# Altium project dory-x.PrjPcb (part 9 of 12)
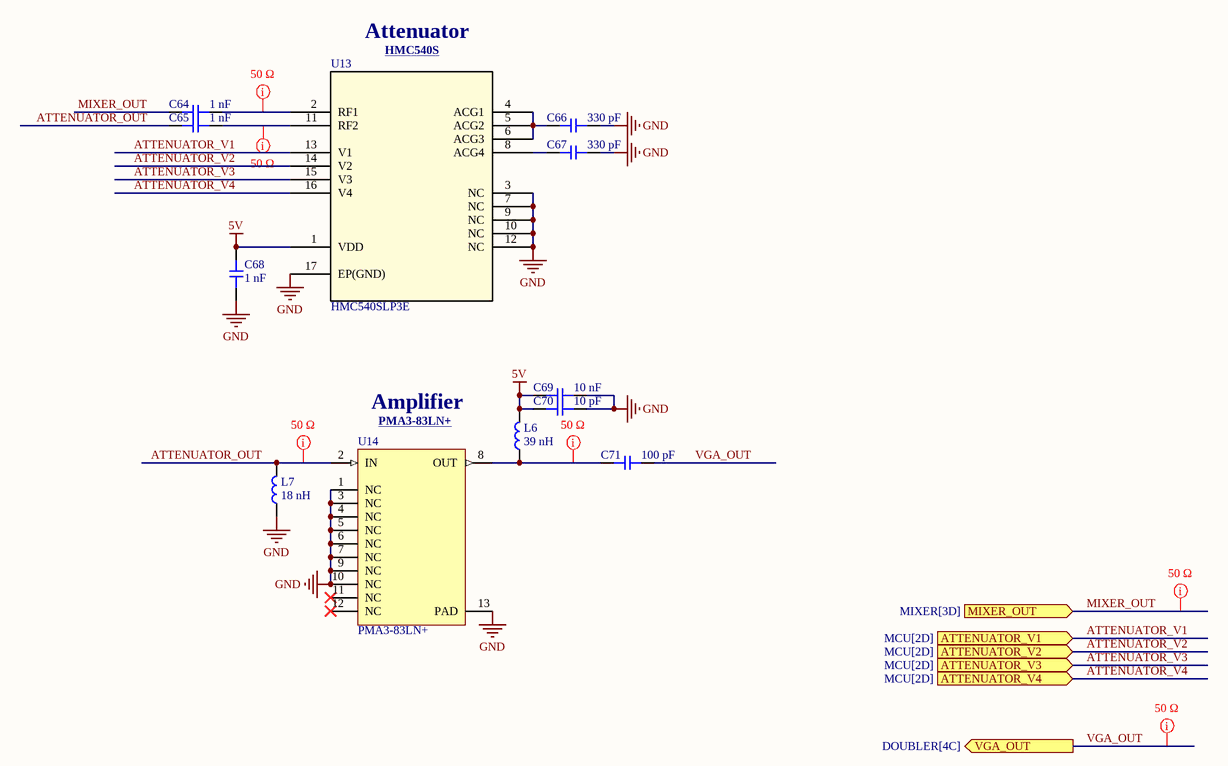
[diagram p15: VGA.SchDoc]

## Sheet VGA.SchDoc (continued)

### Library data of the parts (continued)
U14 = PMA3-83LN+: 1.3dB 0.5GHz~8GHz 21.3dB , LTE, SATCOM, UMTS, WiFi, WiMAX, WLAN QFN-12-EP(3x3) RF Amplifiers ROHS; Manufacturer: Mini-Circuits; Bandwidth: 7.5GHz; Gain: 19.9dB; Impedance: 50Ω; Clock Frequency: 8GHz; Max Junction Temperature (Tj): 150°C; Max Power Dissipation: 950mW; Max Supply Voltage: 6V; Noise Figure: 2.2dB; P1dB: 18dBm; Manufacturer Part Number: PMA3-83LN+; Supplier: DigiKey; Supplier Part Number: 3157-PMA3-83LN+CT-ND; RoHS: Compliant; Category: RF Amplifiers; Stock: 11975; Pricing: 1=23.6, 20=18.852, 50=15.696, 100=14.124, 200=12.43205, 500=11.36404, 2000=9.60007 (USD); Export Control Classification Number (ECCN) Code: EAR99; Height: 990.6µm; Introduction Date: 2015-09-21; Lifecycle Status: Production; Max Operating Temperature: 105°C; Min Operating Temperature: -40°C; REACH SVHC: Yes; ComponentLink1URL: https://datasheet.octopart.com:443/PMA3-83LN%2B-Mini-Circuits-datasheet-180702334.pdf?src-supplier=IHS; ComponentLink1Description: https://datasheet.octopart.com:443/PMA3-83LN%2B-Mini-Circuits-datasheet-180702334.pdf?src-supplier=IHS; ComponentLink2URL: https://datasheet.octopart.com:443/PMA3-83LN%2B-Mini-Circuits-datasheet-86645527.pdf?src-supplier=Upverter; ComponentLink2Description: https://datasheet.octopart.com:443/PMA3-83LN%2B-Mini-Circuits-datasheet-86645527.pdf?src-supplier=Upverter; ComponentLink3URL: https://sigma.octopart.com:443/153600622/technical_drawing/Mini-Circuits-PMA3-83LN%2B.pdf?src-supplier=Upverter; ComponentLink3Description: https://sigma.octopart.com:443/153600622/technical_drawing/Mini-Circuits-PMA3-83LN%2B.pdf?src-supplier=Upverter

## Sheet DOUBLER.SchDoc: Titan Yuan
size Letter; DrawnBy: Titan Yuan; SheetNumber: 5; SheetTotal: 8
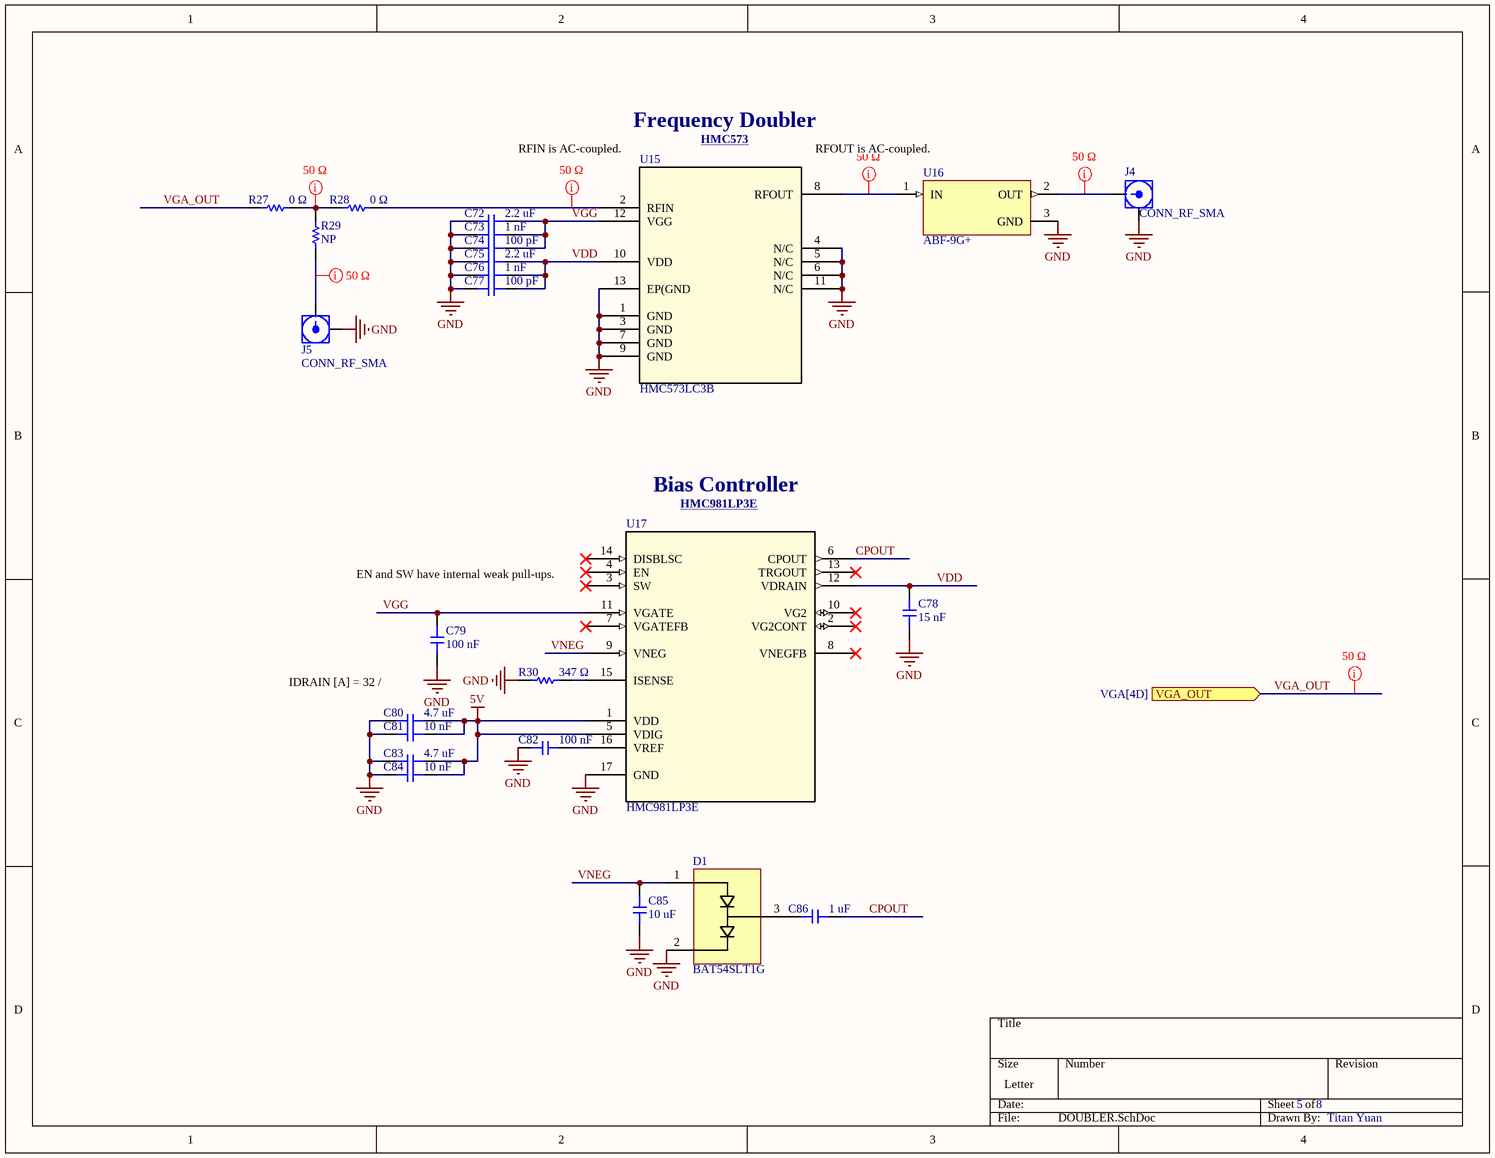
[diagram p4: DOUBLER.SchDoc]

### Parts
C72  2.2 uF  [CAP_0603]
C73  1 nF  [CAP_0402]
C74  100 pF  [CAP_0402]
C75  2.2 uF  [CAP_0603]
C76  1 nF  [CAP_0402]
C77  100 pF  [CAP_0402]
C78  15 nF  [CAP_0402]
C79  100 nF  [CAP_0402]
C80  4.7 uF  [CAP_0603]
C81  10 nF  [CAP_0402]
C82  100 nF  [CAP_0402]
C83  4.7 uF  [CAP_0603]
C84  10 nF  [CAP_0402]
C85  10 uF  [CAP_0805]
C86  1 uF  [CAP_0603]
D1  BAT54SLT1G  [BAT54SL]
J4  CONN_RF_SMA  [142-0701-801]
J5  CONN_RF_SMA  [142-0701-801]
R27  0 Ω  [RES_0402]
R28  0 Ω  [RES_0402]
R29  NP  [RES_0402]
R30  347 Ω  [RES_0603]
U15  HMC573LC3B  [HE_12_1_ADI]
U16  ABF-9G+  [PL-764]
U17  HMC981LP3E  [QFN16_3X3_ADI]

### Ports
VGA_OUT (in, see VGA[4D])

### Nets
5V: C80.2 C81.2 C83.2 C84.2 U17.1(VDD) U17.5(VDIG)
GND: C72.2 C73.2 C74.2 C75.2 C76.2 C77.2 C78.1 C79.1 C80.1 C81.1 C82.1 C83.1 C84.1 C85.1 D1.2 J4.2 J5.2 R30.1 U15.1(GND) U15.3(GND) U15.4(N/C) U15.5(N/C) U15.6(N/C) U15.7(GND) U15.9(GND) U15.11(N/C) U15.13(EP(GND) U16.3(GND) U17.17(GND)
CPOUT: C86.2 U17.6(CPOUT)  [project net CPOUT_5]
VDD: C75.1 C76.1 C77.1 C78.2 U15.10(VDD) U17.12(VDRAIN)  [project net VDD_5]
VGA_OUT: R27.1 ; port VGA_OUT
VGG: C72.1 C73.1 C74.1 C79.2 U15.12(VGG) U17.11(VGATE)  [project net VGG_5]
VNEG: C85.2 D1.1 U17.9(VNEG)  [project net VNEG_5]
NetC82_2: C82.2 U17.16(VREF)
NetC86_1: C86.1 D1.3
NetJ4_1: J4.1 U16.2(OUT)
NetJ5_1: J5.1 R29.2
NetR27_2: R27.2 R28.1 R29.1
NetR28_2: R28.2 U15.2(RFIN)
NetR30_2: R30.2 U17.15(ISENSE)
NetU15_8: U15.8(RFOUT) U16.1(IN)

Not connected (* = marked no-connect by the designer): U17 2(VG2CONT)* 3(SW)* 4(EN)* 7(VGATEFB)* 8(VNEGFB)* 10(VG2)* 13(TRGOUT)* 14(DISBLSC)*

### Layout directives
net class 50 Ω: NetJ4_1, NetJ5_1, NetR27_2, NetR28_2, NetU15_8, VGA_OUT

### Notes on the sheet
- (near U15) RFIN is AC-coupled.
- Frequency Doubler
- (near U15) HMC573 <https://www.analog.com/en/products/hmc573.html>
- RFOUT is AC-coupled.
- Bias Controller
- (near U17) HMC981LP3E <https://www.analog.com/en/products/hmc981lp3e.html>
- EN and SW have internal weak pull-ups.
- IDRAIN [A] = 32 / @{"Id":"COOUFFRD\UTDWNBPI","ObjectType":2}
### Library data of the parts
C72 C75 = CAP: 25V 2.2uF X7R ±10% 0603 Multilayer Ceramic Capacitors MLCC - SMD/SMT ROHS; Manufacturer: Murata Electronics; Manufacturer Part Number: GRM188Z71E225KE43D; Manufacturer Lifecycle Status: IN PRODUCTION; Tolerance: +-10%; Value: 2.2µF; Voltage Rating: 25 V; Dielectric: Ceramic; Package Size: 0603; Supplier: DigiKey; Supplier Part Number: 490-GRM188Z71E225KE43DCT-ND; RoHS: Compliant; Category: Ceramic Capacitors; Stock: 81169; Pricing: 1=0.16, 10=0.092, 50=0.0704, 100=0.0565, 500=0.04888, 1000=0.04487 (USD); Case/Package: 0603; Dielectric Material: Ceramic; Export Control Classification Number (ECCN) Code: EAR99; Height: 800µm; Harmonized Tariff Schedule (HTS) Code: 8532.24.00.20; Introduction Date: 2017-02-21; Length: 1.6mm; Lifecycle Status: Production; Material: Ceramic; Max Operating Temperature: 125°C; Min Operating Temperature: -55°C; Mounting Technology: Surface Mount; Number of Terminals: 2; REACH SVHC: Yes; Thickness: 800µm; Voltage Rating (DC): 25V; Width: 800µm; ComponentLink1URL: https://datasheet.octopart.com:443/GRM188Z71E225KE43D-Murata-datasheet-141276026.pdf?src-supplier=Geoflip; ComponentLink1Description: https://datasheet.octopart.com:443/GRM188Z71E225KE43D-Murata-datasheet-141276026.pdf?src-supplier=Geoflip; ComponentLink2URL: https://datasheet.octopart.com:443/GRM188Z71E225KE43D-Murata-datasheet-165579666.pdf?src-supplier=TME; ComponentLink2Description: https://datasheet.octopart.com:443/GRM188Z71E225KE43D-Murata-datasheet-165579666.pdf?src-supplier=TME; ComponentLink3URL: https://datasheet.octopart.com:443/GRM188Z71E225KE43D-Murata-datasheet-140705919.pdf?src-supplier=Ciiva; ComponentLink3Description: https://datasheet.octopart.com:443/GRM188Z71E225KE43D-Murata-datasheet-140705919.pdf?src-supplier=Ciiva; ComponentLink4URL: https://datasheet.octopart.com:443/GRM188Z71E225KE43D-Murata-datasheet-138743437.pdf?src-supplier=Ciiva; ComponentLink4Description: https://datasheet.octopart.com:443/GRM188Z71E225KE43D-Murata-datasheet-138743437.pdf?src-supplier=Ciiva; ComponentLink5URL: http://sigma.octopart.com:80/reach_statement/Murata-company-16.pdf?src-supplier=Compliance+Statements; ComponentLink5Description: http://sigma.octopart.com:80/reach_statement/Murata-company-16.pdf?src-supplier=Compliance+Statements
C73 C76 = CAP: 50V 1nF X7R ±10% 0402 Multilayer Ceramic Capacitors MLCC - SMD/SMT ROHS; Manufacturer: Yageo; Manufacturer Part Number: CC0402KRX7R9BB102; Tolerance: +-10%; Insulation Resistance: 100GΩ; Temperature Coefficient: 30ppm/°C; Voltage Rating: 50 V; Dielectric: Ceramic; Package Size: 0402; Supplier: DigiKey; Supplier Part Number: 311-1036-1-ND; RoHS: Compliant; Category: Ceramic Capacitors; Stock: 3090255; Pricing: 1=0.08, 10=0.004 (USD); Value: 1nF; Case/Package: 0402; Case Code (Imperial): 0402; Case Code (Metric): 1005; China RoHS: Compliant; Composition: Ceramic; Country of Origin: Mainland China, Taiwan; Depth: 500µm; Dielectric Material: Ceramic; Export Control Classification Number (ECCN) Code: EAR99; Halogen Free: Halogen Free; Height: 500µm; Harmonized Tariff Schedule (HTS) Code: 8532.24.00.20; Introduction Date: 2003-01-27; Lead Free: Lead Free; Length: 1mm; Lifecycle Status: Production; Material: Ceramic; Max Operating Temperature: 125°C; Min Operating Temperature: -55°C; Mounting Technology: Surface Mount; Pins: 2; Number of Terminals: 2; Radiation Hardening: No; REACH SVHC: Yes; Schedule B: 8532240020, 8532240020|8532240020|8532240020|8532240020|8532240020|8532240020|8532240020|8532240020|8532240020|8532240020|8532240020|8532240020|8532240020|8532240020|8532240020|8532240020|8532240020|8532240020|8532240020|8532240020|8532240020|8532240020|8532240020|85; Termination: SMD/SMT; Thickness: 558.8µm; Voltage: 50V; Voltage Rating (AC): 50V; Voltage Rating (DC): 50V; Width: 500µm; ComponentLink1URL: https://datasheet.octopart.com:443/CC0402KRX7R9BB102-Yageo-datasheet-177165144.pdf?src-supplier=IHS; ComponentLink1Description: https://datasheet.octopart.com:443/CC0402KRX7R9BB102-Yageo-datasheet-177165144.pdf?src-supplier=IHS; ComponentLink2URL: https://datasheet.octopart.com:443/CC0402KRX7R9BB102-Yageo-datasheet-82288757.pdf?src-supplier=Upverter; ComponentLink2Description: https://datasheet.octopart.com:443/CC0402KRX7R9BB102-Yageo-datasheet-82288757.pdf?src-supplier=Upverter; ComponentLink3URL: https://datasheet.octopart.com:443/CC0402KRX7R9BB102-Yageo-datasheet-78855684.pdf?src-supplier=Upverter; ComponentLink3Description: https://datasheet.octopart.com:443/CC0402KRX7R9BB102-Yageo-datasheet-78855684.pdf?src-supplier=Upverter; ComponentLink4URL: https://datasheet.octopart.com/CC0402KRX7R9BB102-Yageo-datasheet-10883670.pdf; ComponentLink4Description: https://datasheet.octopart.com/CC0402KRX7R9BB102-Yageo-datasheet-10883670.pdf; ComponentLink5URL: https://datasheet.octopart.com:443/CC0402KRX7R9BB102-Yageo-datasheet-147453679.pdf?src-supplier=Farnell; ComponentLink5Description: https://datasheet.octopart.com:443/CC0402KRX7R9BB102-Yageo-datasheet-147453679.pdf?src-supplier=Farnell; ComponentLink6URL: https://datasheet.octopart.com:443/CC0402KRX7R9BB102-Yageo-datasheet-151948686.pdf?src-supplier=Farnell; ComponentLink6Description: https://datasheet.octopart.com:443/CC0402KRX7R9BB102-Yageo-datasheet-151948686.pdf?src-supplier=Farnell; ComponentLink7URL: https://datasheet.octopart.com:443/CC0402KRX7R9BB102-Phycomp-datasheet-500777.pdf?src-supplier=Farnell; ComponentLink7Description: https://datasheet.octopart.com:443/CC0402KRX7R9BB102-Phycomp-datasheet-500777.pdf?src-supplier=Farnell; ComponentLink8URL: https://datasheet.octopart.com:443/CC0402KRX7R9BB102-Yageo-datasheet-5301394.pdf?src-supplier=Newark; ComponentLink8Description: https://datasheet.octopart.com:443/CC0402KRX7R9BB102-Yageo-datasheet-5301394.pdf?src-supplier=Newark; ComponentLink9URL: https://datasheet.octopart.com:443/CC0402KRX7R9BB102-Yageo-datasheet-62336348.pdf?src-supplier=Newark; ComponentLink9Description: https://datasheet.octopart.com:443/CC0402KRX7R9BB102-Yageo-datasheet-62336348.pdf?src-supplier=Newark; ComponentLink10URL: https://datasheet.octopart.com:443/CC0402KRX7R9BB102-Yageo-datasheet-182878162.pdf?src-supplier=Newark; ComponentLink10Description: https://datasheet.octopart.com:443/CC0402KRX7R9BB102-Yageo-datasheet-182878162.pdf?src-supplier=Newark; ComponentLink11URL: https://datasheet.octopart.com:443/CC0402KRX7R9BB102-Phycomp-datasheet-499490.pdf?src-supplier=element14; ComponentLink11Description: https://datasheet.octopart.com:443/CC0402KRX7R9BB102-Phycomp-datasheet-499490.pdf?src-supplier=element14; ComponentLink12URL: https://datasheet.octopart.com:443/CC0402KRX7R9BB102-Yageo-datasheet-8701427.pdf?src-supplier=element14; ComponentLink12Description: https://datasheet.octopart.com:443/CC0402KRX7R9BB102-Yageo-datasheet-8701427.pdf?src-supplier=element14; ComponentLink13URL: https://datasheet.octopart.com:443/CC0402KRX7R9BB102-Yageo-datasheet-166511530.pdf?src-supplier=Future+Electronics; ComponentLink13Description: https://datasheet.octopart.com:443/CC0402KRX7R9BB102-Yageo-datasheet-166511530.pdf?src-supplier=Future+Electronics; ComponentLink14URL: https://datasheet.octopart.com:443/CC0402KRX7R9BB102-Yageo-datasheet-137700082.pdf?src-supplier=Future+Electronics; ComponentLink14Description: https://datasheet.octopart.com:443/CC0402KRX7R9BB102-Yageo-datasheet-137700082.pdf?src-supplier=Future+Electronics; ComponentLink15URL: https://datasheet.octopart.com:443/CC0402KRX7R9BB102-Yageo-datasheet-137700084.pdf?src-supplier=Future+Electronics; ComponentLink15Description: https://datasheet.octopart.com:443/CC0402KRX7R9BB102-Yageo-datasheet-137700084.pdf?src-supplier=Future+Electronics; ComponentLink16URL: https://datasheet.octopart.com:443/CC0402KRX7R9BB102-Yageo-datasheet-78855685.pdf?src-supplier=Future+Electronics; ComponentLink16Description: https://datasheet.octopart.com:443/CC0402KRX7R9BB102-Yageo-datasheet-78855685.pdf?src-supplier=Future+Electronics; ComponentLink17URL: https://datasheet.octopart.com:443/CC0402KRX7R9BB102-Yageo-datasheet-27626582.pdf?src-supplier=Future+Electronics; ComponentLink17Description: https://datasheet.octopart.com:443/CC0402KRX7R9BB102-Yageo-datasheet-27626582.pdf?src-supplier=Future+Electronics; ComponentLink18URL: https://datasheet.octopart.com:443/CC0402KRX7R9BB102-Yageo-datasheet-24578986.pdf?src-supplier=Future+Electronics; ComponentLink18Description: https://datasheet.octopart.com:443/CC0402KRX7R9BB102-Yageo-datasheet-24578986.pdf?src-supplier=Future+Electronics; ComponentLink19URL: https://datasheet.octopart.com:443/CC0402KRX7R9BB102-Yageo-datasheet-15895757.pdf?src-supplier=Future+Electronics; ComponentLink19Description: https://datasheet.octopart.com:443/CC0402KRX7R9BB102-Yageo-datasheet-15895757.pdf?src-supplier=Future+Electronics; ComponentLink20URL: https://datasheet.octopart.com:443/CC0402KRX7R9BB102-Yageo-datasheet-12526321.pdf?src-supplier=Future+Electronics; ComponentLink20Description: https://datasheet.octopart.com:443/CC0402KRX7R9BB102-Yageo-datasheet-12526321.pdf?src-supplier=Future+Electronics; ComponentLink21URL: https://datasheet.octopart.com:443/CC0402KRX7R9BB102-Yageo-datasheet-8324192.pdf?src-supplier=Future+Electronics; ComponentLink21Description: https://datasheet.octopart.com:443/CC0402KRX7R9BB102-Yageo-datasheet-8324192.pdf?src-supplier=Future+Electronics; ComponentLink22URL: https://datasheet.octopart.com:443/CC0402KRX7R9BB102-Yageo-datasheet-68298032.pdf?src-supplier=Future+Electronics; ComponentLink22Description: https://datasheet.octopart.com:443/CC0402KRX7R9BB102-Yageo-datasheet-68298032.pdf?src-supplier=Future+Electronics; ComponentLink23URL: https://datasheet.octopart.com:443/CC0402KRX7R9BB102-Yageo-datasheet-178018854.pdf?src-supplier=Burklin+Elektronik; ComponentLink23Description: https://datasheet.octopart.com:443/CC0402KRX7R9BB102-Yageo-datasheet-178018854.pdf?src-supplier=Burklin+Elektronik; ComponentLink24URL: https://datasheet.octopart.com:443/CC0402KRX7R9BB102-Yageo-Group-datasheet-165992755.pdf?src-supplier=ODG+(Origin+Data+Global); ComponentLink24Description: https://datasheet.octopart.com:443/CC0402KRX7R9BB102-Yageo-Group-datasheet-165992755.pdf?src-supplier=ODG+(Origin+Data+Global); ComponentLink25URL: https://datasheet.octopart.com:443/CC0402KRX7R9BB102-Yageo-datasheet-120101875.pdf?src-supplier=Megastar; ComponentLink25Description: https://datasheet.octopart.com:443/CC0402KRX7R9BB102-Yageo-datasheet-120101875.pdf?src-supplier=Megastar; ComponentLink26URL: https://datasheet.octopart.com:443/CC0402KRX7R9BB102-Yageo-datasheet-118396.pdf?src-supplier=DigiKey; ComponentLink26Description: https://datasheet.octopart.com:443/CC0402KRX7R9BB102-Yageo-datasheet-118396.pdf?src-supplier=DigiKey; ComponentLink27URL: http://sigma.octopart.com:80/conflict_mineral_statement/Yageo-company-3.pdf?src-supplier=Compliance+Statements; ComponentLink27Description: http://sigma.octopart.com:80/conflict_mineral_statement/Yageo-company-3.pdf?src-supplier=Compliance+Statements; ComponentLink28URL: http://sigma.octopart.com:80/rohs_statement/Yageo-company-2.pdf?src-supplier=Compliance+Statements; ComponentLink28Description: http://sigma.octopart.com:80/rohs_statement/Yageo-company-2.pdf?src-supplier=Compliance+Statements
C74 C77 = CAP: 50V 100pF NP0 ±5% 0402 Multilayer Ceramic Capacitors MLCC - SMD/SMT ROHS; Manufacturer: Yageo; Manufacturer Part Number: CC0402JRNPO9BN101; Tolerance: +-5%; Insulation Resistance: 100GΩ; Temperature Coefficient: 30ppm/°C; Voltage Rating: 50 V; Dielectric: Ceramic; Package Size: 0402; Supplier: DigiKey; Supplier Part Number: 311-1024-1-ND; RoHS: Compliant; Category: Ceramic Capacitors; Stock: 3080901; Pricing: 1=0.08, 10=0.003, 10000=0.0032, 20000=0.0031, 30000=0.00304, 50000=0.00283, 70000=0.00282 (USD); Value: 100pF; Case/Package: 0402; Case Code (Imperial): 0402; Case Code (Metric): 1005; China RoHS: Compliant; Composition: Ceramic; Depth: 500µm; Dielectric Material: Ceramic; Halogen Free: Halogen Free; Height: 500µm; Lead Free: Lead Free; Length: 1mm; Lifecycle Status: Production; Max Operating Temperature: 125°C; Min Operating Temperature: -55°C; Mounting Technology: Surface Mount; Pins: 2; Number of Terminals: 2; Radiation Hardening: No; REACH SVHC: Yes; Schedule B: 8532240020, 8532240020|8532240020|8532240020|8532240020|8532240020|8532240020|8532240020|8532240020|8532240020|8532240020|8532240020|8532240020|8532240020|8532240020|8532240020|8532240020|8532240020|8532240020|8532240020|8532240020|8532240020|8532240020|8532240020|85; Termination: SMD/SMT; Thickness: 558.8µm; Voltage: 50V; Voltage Rating (AC): 50V; Voltage Rating (DC): 50V; Width: 500µm; ComponentLink1URL: https://datasheet.octopart.com:443/CC0402JRNPO9BN101-Yageo-datasheet-182140217.pdf?src-supplier=IHS; ComponentLink1Description: https://datasheet.octopart.com:443/CC0402JRNPO9BN101-Yageo-datasheet-182140217.pdf?src-supplier=IHS; ComponentLink2URL: https://datasheet.octopart.com:443/CC0402JRNPO9BN101-Yageo-datasheet-10406438.pdf?src-supplier=element14+APAC; ComponentLink2Description: https://datasheet.octopart.com:443/CC0402JRNPO9BN101-Yageo-datasheet-10406438.pdf?src-supplier=element14+APAC; ComponentLink3URL: https://datasheet.octopart.com:443/CC0402JRNPO9BN101-Yageo-datasheet-151948684.pdf?src-supplier=element14+APAC; ComponentLink3Description: https://datasheet.octopart.com:443/CC0402JRNPO9BN101-Yageo-datasheet-151948684.pdf?src-supplier=element14+APAC; ComponentLink4URL: https://datasheet.octopart.com:443/CC0402JRNPO9BN101-Yageo-datasheet-67645495.pdf?src-supplier=element14+APAC; ComponentLink4Description: https://datasheet.octopart.com:443/CC0402JRNPO9BN101-Yageo-datasheet-67645495.pdf?src-supplier=element14+APAC; ComponentLink5URL: https://datasheet.octopart.com:443/CC0402JRNPO9BN101-Yageo-datasheet-10882999.pdf?src-supplier=element14+APAC; ComponentLink5Description: https://datasheet.octopart.com:443/CC0402JRNPO9BN101-Yageo-datasheet-10882999.pdf?src-supplier=element14+APAC; ComponentLink6URL: https://datasheet.octopart.com:443/CC0402JRNPO9BN101-Yageo-datasheet-78855684.pdf?src-supplier=Upverter; ComponentLink6Description: https://datasheet.octopart.com:443/CC0402JRNPO9BN101-Yageo-datasheet-78855684.pdf?src-supplier=Upverter; ComponentLink7URL: https://datasheet.octopart.com:443/CC0402JRNPO9BN101-Yageo-Group-datasheet-188689597.pdf?src-supplier=Farnell; ComponentLink7Description: https://datasheet.octopart.com:443/CC0402JRNPO9BN101-Yageo-Group-datasheet-188689597.pdf?src-supplier=Farnell; ComponentLink8URL: https://datasheet.octopart.com:443/CC0402JRNPO9BN101-Yageo-datasheet-10621397.pdf?src-supplier=Farnell; ComponentLink8Description: https://datasheet.octopart.com:443/CC0402JRNPO9BN101-Yageo-datasheet-10621397.pdf?src-supplier=Farnell; ComponentLink9URL: https://datasheet.octopart.com:443/CC0402JRNPO9BN101-Yageo-datasheet-65873193.pdf?src-supplier=Newark; ComponentLink9Description: https://datasheet.octopart.com:443/CC0402JRNPO9BN101-Yageo-datasheet-65873193.pdf?src-supplier=Newark; ComponentLink10URL: https://datasheet.octopart.com:443/CC0402JRNPO9BN101-Yageo-datasheet-5301394.pdf?src-supplier=Newark; ComponentLink10Description: https://datasheet.octopart.com:443/CC0402JRNPO9BN101-Yageo-datasheet-5301394.pdf?src-supplier=Newark; ComponentLink11URL: https://datasheet.octopart.com:443/CC0402JRNPO9BN101-Yageo-datasheet-182966517.pdf?src-supplier=Newark; ComponentLink11Description: https://datasheet.octopart.com:443/CC0402JRNPO9BN101-Yageo-datasheet-182966517.pdf?src-supplier=Newark; ComponentLink12URL: https://datasheet.octopart.com:443/CC0402JRNPO9BN101-Yageo-datasheet-137875056.pdf?src-supplier=Future+Electronics; ComponentLink12Description: https://datasheet.octopart.com:443/CC0402JRNPO9BN101-Yageo-datasheet-137875056.pdf?src-supplier=Future+Electronics; ComponentLink13URL: https://datasheet.octopart.com:443/CC0402JRNPO9BN101-Yageo-datasheet-136957424.pdf?src-supplier=Future+Electronics; ComponentLink13Description: https://datasheet.octopart.com:443/CC0402JRNPO9BN101-Yageo-datasheet-136957424.pdf?src-supplier=Future+Electronics; ComponentLink14URL: https://datasheet.octopart.com:443/CC0402JRNPO9BN101-Yageo-datasheet-137700082.pdf?src-supplier=Future+Electronics; ComponentLink14Description: https://datasheet.octopart.com:443/CC0402JRNPO9BN101-Yageo-datasheet-137700082.pdf?src-supplier=Future+Electronics; ComponentLink15URL: https://datasheet.octopart.com:443/CC0402JRNPO9BN101-Yageo-datasheet-62126864.pdf?src-supplier=Future+Electronics; ComponentLink15Description: https://datasheet.octopart.com:443/CC0402JRNPO9BN101-Yageo-datasheet-62126864.pdf?src-supplier=Future+Electronics; ComponentLink16URL: https://datasheet.octopart.com:443/CC0402JRNPO9BN101-Yageo-datasheet-62091628.pdf?src-supplier=Future+Electronics; ComponentLink16Description: https://datasheet.octopart.com:443/CC0402JRNPO9BN101-Yageo-datasheet-62091628.pdf?src-supplier=Future+Electronics; ComponentLink17URL: https://datasheet.octopart.com:443/CC0402JRNPO9BN101-Yageo-datasheet-24578986.pdf?src-supplier=Future+Electronics; ComponentLink17Description: https://datasheet.octopart.com:443/CC0402JRNPO9BN101-Yageo-datasheet-24578986.pdf?src-supplier=Future+Electronics; ComponentLink18URL: https://datasheet.octopart.com:443/CC0402JRNPO9BN101-Yageo-datasheet-16730043.pdf?src-supplier=Future+Electronics; ComponentLink18Description: https://datasheet.octopart.com:443/CC0402JRNPO9BN101-Yageo-datasheet-16730043.pdf?src-supplier=Future+Electronics; ComponentLink19URL: https://datasheet.octopart.com:443/CC0402JRNPO9BN101-Yageo-datasheet-12589826.pdf?src-supplier=Future+Electronics; ComponentLink19Description: https://datasheet.octopart.com:443/CC0402JRNPO9BN101-Yageo-datasheet-12589826.pdf?src-supplier=Future+Electronics; ComponentLink20URL: https://datasheet.octopart.com:443/CC0402JRNPO9BN101-Yageo-datasheet-8817079.pdf?src-supplier=element14; ComponentLink20Description: https://datasheet.octopart.com:443/CC0402JRNPO9BN101-Yageo-datasheet-8817079.pdf?src-supplier=element14; ComponentLink21URL: https://datasheet.octopart.com:443/CC0402JRNPO9BN101-Yageo-datasheet-8324240.pdf?src-supplier=element14; ComponentLink21Description: https://datasheet.octopart.com:443/CC0402JRNPO9BN101-Yageo-datasheet-8324240.pdf?src-supplier=element14; ComponentLink22URL: https://datasheet.octopart.com:443/CC0402JRNPO9BN101-Yageo-datasheet-504625.pdf?src-supplier=element14; ComponentLink22Description: https://datasheet.octopart.com:443/CC0402JRNPO9BN101-Yageo-datasheet-504625.pdf?src-supplier=element14; ComponentLink23URL: https://datasheet.octopart.com:443/CC0402JRNPO9BN101-Yageo-datasheet-5321569.pdf?src-supplier=element14; ComponentLink23Description: https://datasheet.octopart.com:443/CC0402JRNPO9BN101-Yageo-datasheet-5321569.pdf?src-supplier=element14; ComponentLink24URL: https://datasheet.octopart.com:443/CC0402JRNPO9BN101-Yageo-datasheet-68296204.pdf?src-supplier=Megastar; ComponentLink24Description: https://datasheet.octopart.com:443/CC0402JRNPO9BN101-Yageo-datasheet-68296204.pdf?src-supplier=Megastar; ComponentLink25URL: http://sigma.octopart.com:80/conflict_mineral_statement/Yageo-company-3.pdf?src-supplier=Compliance+Statements; ComponentLink25Description: http://sigma.octopart.com:80/conflict_mineral_statement/Yageo-company-3.pdf?src-supplier=Compliance+Statements; ComponentLink26URL: http://sigma.octopart.com:80/rohs_statement/Yageo-company-2.pdf?src-supplier=Compliance+Statements; ComponentLink26Description: http://sigma.octopart.com:80/rohs_statement/Yageo-company-2.pdf?src-supplier=Compliance+Statements
C78 = CAP: Ceramic Capacitor, Multilayer, Ceramic, 50V, 10% +Tol, 10% -Tol, X7R, 0.15 TC, 0.015uF, Surface Mount, 0402; Manufacturer: Yageo; Manufacturer Part Number: AC0402KRX7R9BB153; Tolerance: +-10%; Value: 15nF; Voltage Rating: 50 V; Dielectric: Ceramic; Package Size: 0402; Supplier: DigiKey; Supplier Part Number: 13-AC0402KRX7R9BB153CT-ND; RoHS: Compliant; Category: Ceramic Capacitors; Stock: 11656; Pricing: 1=0.1, 10=0.047, 50=0.0318, 100=0.0274, 500=0.0199, 1000=0.0176, 2500=0.01519, 5000=0.01374 (USD); China RoHS: Compliant; Country of Origin: Mainland China, Taiwan; Dielectric Material: Ceramic; Export Control Classification Number (ECCN) Code: EAR99; Height: 500µm; Harmonized Tariff Schedule (HTS) Code: 8532.24.00.20; Introduction Date: 2021-06-08; Length: 1mm; Lifecycle Status: Production; Max Operating Temperature: 125°C; Min Operating Temperature: -55°C; Mounting Technology: Surface Mount; Number of Terminals: 2; REACH SVHC: Yes; Voltage Rating (DC): 50V; Width: 500µm; ComponentLink1URL: https://datasheet.octopart.com:443/AC0402KRX7R9BB153-Yageo-datasheet-170333968.pdf?src-supplier=IHS; ComponentLink1Description: https://datasheet.octopart.com:443/AC0402KRX7R9BB153-Yageo-datasheet-170333968.pdf?src-supplier=IHS; ComponentLink2URL: https://datasheet.octopart.com:443/AC0402KRX7R9BB153-Yageo-datasheet-181964350.pdf?src-supplier=Farnell; ComponentLink2Description: https://datasheet.octopart.com:443/AC0402KRX7R9BB153-Yageo-datasheet-181964350.pdf?src-supplier=Farnell; ComponentLink3URL: http://sigma.octopart.com:80/conflict_mineral_statement/Yageo-company-3.pdf?src-supplier=Compliance+Statements; ComponentLink3Description: http://sigma.octopart.com:80/conflict_mineral_statement/Yageo-company-3.pdf?src-supplier=Compliance+Statements; ComponentLink4URL: http://sigma.octopart.com:80/rohs_statement/Yageo-company-2.pdf?src-supplier=Compliance+Statements; ComponentLink4Description: http://sigma.octopart.com:80/rohs_statement/Yageo-company-2.pdf?src-supplier=Compliance+Statements
C79 C82 = CAP: Ceramic Capacitor, Ceramic, 50V, 10% +Tol, 10% -Tol, X7R, 15% TC, 0.1uF, Surface Mount, 0402; Manufacturer: Yageo; Manufacturer Part Number: CC0402KPX7R9BB104; Tolerance: +-10%; Value: 100nF; Voltage Rating: 50 V; Dielectric: Ceramic; Package Size: 0402; Supplier: DigiKey; Supplier Part Number: 13-CC0402KPX7R9BB104CT-ND; RoHS: Compliant; Category: Ceramic Capacitors; Stock: 40680; Pricing: 1=0.1, 10=0.053, 50=0.0364, 100=0.0313, 500=0.02292, 1000=0.02035, 2500=0.01764, 5000=0.01601 (USD); Case/Package: 0402; China RoHS: Compliant; Dielectric Material: Ceramic; Height: 500µm; Lead Free: Lead Free; Length: 1mm; Lifecycle Status: Production; Max Operating Temperature: 125°C; Min Operating Temperature: -55°C; Mounting Technology: Surface Mount; Number of Terminals: 2; REACH SVHC: Yes; Voltage Rating (DC): 50V; Width: 500µm; ComponentLink1URL: https://datasheet.octopart.com:443/CC0402KPX7R9BB104-Yageo-datasheet-177165144.pdf?src-supplier=IHS; ComponentLink1Description: https://datasheet.octopart.com:443/CC0402KPX7R9BB104-Yageo-datasheet-177165144.pdf?src-supplier=IHS; ComponentLink2URL: https://datasheet.octopart.com:443/CC0402KPX7R9BB104-Yageo-Group-datasheet-189192896.pdf?src-supplier=Future+Electronics; ComponentLink2Description: https://datasheet.octopart.com:443/CC0402KPX7R9BB104-Yageo-Group-datasheet-189192896.pdf?src-supplier=Future+Electronics; ComponentLink3URL: https://datasheet.octopart.com:443/CC0402KPX7R9BB104-Yageo-datasheet-181967134.pdf?src-supplier=Farnell; ComponentLink3Description: https://datasheet.octopart.com:443/CC0402KPX7R9BB104-Yageo-datasheet-181967134.pdf?src-supplier=Farnell; ComponentLink4URL: https://datasheet.octopart.com/Surface-Mount-Ceramic-Multilayer-Capacitors%3B-General-Purpose-%26-High-Capacitance-Class-2%2C-X7R-Yageo-datasheet-family-114.pdf; ComponentLink4Description: https://datasheet.octopart.com/Surface-Mount-Ceramic-Multilayer-Capacitors%3B-General-Purpose-%26-High-Capacitance-Class-2%2C-X7R-Yageo-datasheet-family-114.pdf; ComponentLink5URL: https://datasheet.octopart.com/CC0402KPX7R9BB104-Yageo-datasheet-10883670.pdf; ComponentLink5Description: https://datasheet.octopart.com/CC0402KPX7R9BB104-Yageo-datasheet-10883670.pdf; ComponentLink6URL: http://sigma.octopart.com:80/rohs_statement/Surface-Mount-Ceramic-Multilayer-Capacitors%3B-General-Purpose-%26-High-Capacitance-Class-2%2C-X7R-Yageo-family-124.pdf?src-supplier=Compliance+Statements; ComponentLink6Description: http://sigma.octopart.com:80/rohs_statement/Surface-Mount-Ceramic-Multilayer-Capacitors%3B-General-Purpose-%26-High-Capacitance-Class-2%2C-X7R-Yageo-family-124.pdf?src-supplier=Compliance+Statements; ComponentLink7URL: http://sigma.octopart.com:80/reach_statement/Surface-Mount-Ceramic-Multilayer-Capacitors%3B-General-Purpose-%26-High-Capacitance-Class-2%2C-X7R-Yageo-family-125.pdf?src-supplier=Compliance+Statements; ComponentLink7Description: http://sigma.octopart.com:80/reach_statement/Surface-Mount-Ceramic-Multilayer-Capacitors%3B-General-Purpose-%26-High-Capacitance-Class-2%2C-X7R-Yageo-family-125.pdf?src-supplier=Compliance+Statements; ComponentLink8URL: http://sigma.octopart.com:80/conflict_mineral_statement/Yageo-company-3.pdf?src-supplier=Compliance+Statements; ComponentLink8Description: http://sigma.octopart.com:80/conflict_mineral_statement/Yageo-company-3.pdf?src-supplier=Compliance+Statements; ComponentLink9URL: http://sigma.octopart.com:80/rohs_statement/Yageo-company-2.pdf?src-supplier=Compliance+Statements; ComponentLink9Description: http://sigma.octopart.com:80/rohs_statement/Yageo-company-2.pdf?src-supplier=Compliance+Statements
C80 C83 = CAP: 10V 4.7uF X7R ±10% 0603 Multilayer Ceramic Capacitors MLCC - SMD/SMT ROHS; Manufacturer: Murata Electronics; Manufacturer Part Number: GRM188Z71A475KE15D; Manufacturer Lifecycle Status: IN PRODUCTION; Tolerance: +-10%; Value: 4.7µF; Voltage Rating: 10 V; Dielectric: Ceramic; Package Size: 0603; Supplier: DigiKey; Supplier Part Number: 490-GRM188Z71A475KE15DCT-ND; RoHS: Compliant; Category: Ceramic Capacitors; Stock: 131654; Pricing: 1=0.22, 10=0.125, 50=0.0894, 100=0.0785, 500=0.0603, 1000=0.05467 (USD); Case/Package: 0603; Country of Origin: Japan, Mainland China, Philippines, Singapore, Thailand; Dielectric Material: Ceramic; Export Control Classification Number (ECCN) Code: EAR99; Height: 800µm; Harmonized Tariff Schedule (HTS) Code: 8532.24.00.20; Introduction Date: 2017-02-21; Length: 1.6mm; Lifecycle Status: Production; Material: Ceramic; Max Operating Temperature: 125°C; Min Operating Temperature: -55°C; Mounting Technology: Surface Mount; Number of Terminals: 2; REACH SVHC: Yes; Thickness: 800µm; Voltage Rating (DC): 10V; Width: 800µm; ComponentLink1URL: https://datasheet.octopart.com:443/GRM188Z71A475KE15D-Murata-datasheet-149523299.pdf?src-supplier=Newark; ComponentLink1Description: https://datasheet.octopart.com:443/GRM188Z71A475KE15D-Murata-datasheet-149523299.pdf?src-supplier=Newark; ComponentLink2URL: https://datasheet.octopart.com:443/GRM188Z71A475KE15D-Murata-datasheet-141276008.pdf?src-supplier=Geoflip; ComponentLink2Description: https://datasheet.octopart.com:443/GRM188Z71A475KE15D-Murata-datasheet-141276008.pdf?src-supplier=Geoflip; ComponentLink3URL: https://datasheet.octopart.com:443/GRM188Z71A475KE15D-Murata-datasheet-165579666.pdf?src-supplier=TME; ComponentLink3Description: https://datasheet.octopart.com:443/GRM188Z71A475KE15D-Murata-datasheet-165579666.pdf?src-supplier=TME; ComponentLink4URL: https://datasheet.octopart.com:443/GRM188Z71A475KE15D-Murata-datasheet-140705913.pdf?src-supplier=Ciiva; ComponentLink4Description: https://datasheet.octopart.com:443/GRM188Z71A475KE15D-Murata-datasheet-140705913.pdf?src-supplier=Ciiva; ComponentLink5URL: https://datasheet.octopart.com:443/GRM188Z71A475KE15D-Murata-datasheet-138743431.pdf?src-supplier=Ciiva; ComponentLink5Description: https://datasheet.octopart.com:443/GRM188Z71A475KE15D-Murata-datasheet-138743431.pdf?src-supplier=Ciiva; ComponentLink6URL: http://sigma.octopart.com:80/reach_statement/Murata-company-16.pdf?src-supplier=Compliance+Statements; ComponentLink6Description: http://sigma.octopart.com:80/reach_statement/Murata-company-16.pdf?src-supplier=Compliance+Statements
C81 C84 = CAP: 50V 10nF X7R ±10% 0402 Multilayer Ceramic Capacitors MLCC - SMD/SMT ROHS; Manufacturer: Yageo; Manufacturer Part Number: CC0402KRX7R9BB103; Tolerance: +-10%; Temperature Coefficient: 30ppm/°C; Voltage Rating: 50 V; Dielectric: Ceramic; Package Size: 0402; Supplier: DigiKey; Supplier Part Number: 311-1349-1-ND; RoHS: Compliant; Category: Ceramic Capacitors; Stock: 2286845; Pricing: 1=0.08, 10=0.003 (USD); Value: 10nF; Case/Package: 0402; Case Code (Imperial): 0402; Case Code (Metric): 1005; China RoHS: Compliant; Composition: Ceramic; Country of Origin: Mainland China, Taiwan; Depth: 500µm; Dielectric Material: Ceramic; Export Control Classification Number (ECCN) Code: EAR99; Halogen Free: Halogen Free; Height: 500µm; Harmonized Tariff Schedule (HTS) Code: 8532.24.00.20; Introduction Date: 2004-02-24; Lead Free: Lead Free; Length: 1mm; Lifecycle Status: Production; Material: Ceramic; Max Operating Temperature: 125°C; Min Operating Temperature: -55°C; Mounting Technology: Surface Mount; Pins: 2; Number of Terminals: 2; Packaging: Cut Tape (CT); Radiation Hardening: No; REACH SVHC: Yes; Schedule B: 8532240020, 8532240020|8532240020|8532240020|8532240020|8532240020|8532240020|8532240020|8532240020|8532240020|8532240020|8532240020|8532240020|8532240020|8532240020, 8532240020|8532240020|8532240020|8532240020|8532240020|8532240020|8532240020|8532240020|8532240020|8532240020|8532240020|8532240020|8532240020|8532240020|8532240020, 8532240020|8532240020|8532240020|8532240020|8532240020|8532240020|8532240020|8532240020|8532240020|8532240020|8532240020|8532240020|8532240020|8532240020|8532240020|8532240020; Termination: SMD/SMT; Thickness: 558.8µm; Voltage: 50V; Voltage Rating (DC): 50V; Width: 500µm; ComponentLink1URL: https://datasheet.octopart.com:443/CC0402KRX7R9BB103-Yageo-datasheet-177165144.pdf?src-supplier=IHS; ComponentLink1Description: https://datasheet.octopart.com:443/CC0402KRX7R9BB103-Yageo-datasheet-177165144.pdf?src-supplier=IHS; ComponentLink2URL: https://datasheet.octopart.com:443/CC0402KRX7R9BB103-Yageo-datasheet-10883670.pdf?src-supplier=Upverter; ComponentLink2Description: https://datasheet.octopart.com:443/CC0402KRX7R9BB103-Yageo-datasheet-10883670.pdf?src-supplier=Upverter; ComponentLink3URL: https://datasheet.octopart.com:443/CC0402KRX7R9BB103-Yageo-datasheet-82288757.pdf?src-supplier=Upverter; ComponentLink3Description: https://datasheet.octopart.com:443/CC0402KRX7R9BB103-Yageo-datasheet-82288757.pdf?src-supplier=Upverter; ComponentLink4URL: https://datasheet.octopart.com:443/CC0402KRX7R9BB103-Yageo-datasheet-78855684.pdf?src-supplier=Upverter; ComponentLink4Description: https://datasheet.octopart.com:443/CC0402KRX7R9BB103-Yageo-datasheet-78855684.pdf?src-supplier=Upverter; ComponentLink5URL: https://datasheet.octopart.com:443/CC0402KRX7R9BB103-Yageo-Group-datasheet-189192896.pdf?src-supplier=Future+Electronics; ComponentLink5Description: https://datasheet.octopart.com:443/CC0402KRX7R9BB103-Yageo-Group-datasheet-189192896.pdf?src-supplier=Future+Electronics; ComponentLink6URL: https://datasheet.octopart.com:443/CC0402KRX7R9BB103-Yageo-datasheet-166511530.pdf?src-supplier=Future+Electronics; ComponentLink6Description: https://datasheet.octopart.com:443/CC0402KRX7R9BB103-Yageo-datasheet-166511530.pdf?src-supplier=Future+Electronics; ComponentLink7URL: https://datasheet.octopart.com:443/CC0402KRX7R9BB103-Yageo-datasheet-137700082.pdf?src-supplier=Future+Electronics; ComponentLink7Description: https://datasheet.octopart.com:443/CC0402KRX7R9BB103-Yageo-datasheet-137700082.pdf?src-supplier=Future+Electronics; ComponentLink8URL: https://datasheet.octopart.com:443/CC0402KRX7R9BB103-Yageo-datasheet-137700084.pdf?src-supplier=Future+Electronics; ComponentLink8Description: https://datasheet.octopart.com:443/CC0402KRX7R9BB103-Yageo-datasheet-137700084.pdf?src-supplier=Future+Electronics; ComponentLink9URL: https://datasheet.octopart.com:443/CC0402KRX7R9BB103-Yageo-datasheet-27626582.pdf?src-supplier=Future+Electronics; ComponentLink9Description: https://datasheet.octopart.com:443/CC0402KRX7R9BB103-Yageo-datasheet-27626582.pdf?src-supplier=Future+Electronics; ComponentLink10URL: https://datasheet.octopart.com:443/CC0402KRX7R9BB103-Yageo-datasheet-15895757.pdf?src-supplier=Future+Electronics; ComponentLink10Description: https://datasheet.octopart.com:443/CC0402KRX7R9BB103-Yageo-datasheet-15895757.pdf?src-supplier=Future+Electronics; ComponentLink11URL: https://datasheet.octopart.com:443/CC0402KRX7R9BB103-Yageo-datasheet-12526321.pdf?src-supplier=Future+Electronics; ComponentLink11Description: https://datasheet.octopart.com:443/CC0402KRX7R9BB103-Yageo-datasheet-12526321.pdf?src-supplier=Future+Electronics; ComponentLink12URL: https://datasheet.octopart.com:443/CC0402KRX7R9BB103-Yageo-datasheet-8324192.pdf?src-supplier=Future+Electronics; ComponentLink12Description: https://datasheet.octopart.com:443/CC0402KRX7R9BB103-Yageo-datasheet-8324192.pdf?src-supplier=Future+Electronics; ComponentLink13URL: https://datasheet.octopart.com:443/CC0402KRX7R9BB103-Yageo-datasheet-147453679.pdf?src-supplier=Farnell; ComponentLink13Description: https://datasheet.octopart.com:443/CC0402KRX7R9BB103-Yageo-datasheet-147453679.pdf?src-supplier=Farnell; ComponentLink14URL: https://datasheet.octopart.com:443/CC0402KRX7R9BB103-Yageo-datasheet-181967450.pdf?src-supplier=Farnell; ComponentLink14Description: https://datasheet.octopart.com:443/CC0402KRX7R9BB103-Yageo-datasheet-181967450.pdf?src-supplier=Farnell; ComponentLink15URL: https://datasheet.octopart.com:443/CC0402KRX7R9BB103-Yageo-datasheet-140260305.pdf?src-supplier=element14+APAC; ComponentLink15Description: https://datasheet.octopart.com:443/CC0402KRX7R9BB103-Yageo-datasheet-140260305.pdf?src-supplier=element14+APAC; ComponentLink16URL: https://datasheet.octopart.com:443/CC0402KRX7R9BB103-Yageo-datasheet-178018856.pdf?src-supplier=Burklin+Elektronik; ComponentLink16Description: https://datasheet.octopart.com:443/CC0402KRX7R9BB103-Yageo-datasheet-178018856.pdf?src-supplier=Burklin+Elektronik; ComponentLink17URL: https://datasheet.octopart.com:443/CC0402KRX7R9BB103-Yageo-Group-datasheet-165992755.pdf?src-supplier=ODG+(Origin+Data+Global); ComponentLink17Description: https://datasheet.octopart.com:443/CC0402KRX7R9BB103-Yageo-Group-datasheet-165992755.pdf?src-supplier=ODG+(Origin+Data+Global); ComponentLink18URL: https://datasheet.octopart.com:443/CC0402KRX7R9BB103-Yageo-datasheet-151948686.pdf?src-supplier=TME; ComponentLink18Description: https://datasheet.octopart.com:443/CC0402KRX7R9BB103-Yageo-datasheet-151948686.pdf?src-supplier=TME; ComponentLink19URL: https://datasheet.octopart.com:443/CC0402KRX7R9BB103-Yageo-datasheet-120101875.pdf?src-supplier=Megastar; ComponentLink19Description: https://datasheet.octopart.com:443/CC0402KRX7R9BB103-Yageo-datasheet-120101875.pdf?src-supplier=Megastar; ComponentLink20URL: https://datasheet.octopart.com:443/CC0402KRX7R9BB103-Yageo-datasheet-8701427.pdf?src-supplier=element14; ComponentLink20Description: https://datasheet.octopart.com:443/CC0402KRX7R9BB103-Yageo-datasheet-8701427.pdf?src-supplier=element14; ComponentLink21URL: https://datasheet.octopart.com:443/CC0402KRX7R9BB103-Yageo-datasheet-499490.pdf?src-supplier=element14; ComponentLink21Description: https://datasheet.octopart.com:443/CC0402KRX7R9BB103-Yageo-datasheet-499490.pdf?src-supplier=element14; ComponentLink22URL: https://datasheet.octopart.com:443/CC0402KRX7R9BB103-Yageo-datasheet-5301394.pdf?src-supplier=element14; ComponentLink22Description: https://datasheet.octopart.com:443/CC0402KRX7R9BB103-Yageo-datasheet-5301394.pdf?src-supplier=element14; ComponentLink23URL: https://datasheet.octopart.com:443/CC0402KRX7R9BB103-Yageo-datasheet-62336348.pdf?src-supplier=Newark; ComponentLink23Description: https://datasheet.octopart.com:443/CC0402KRX7R9BB103-Yageo-datasheet-62336348.pdf?src-supplier=Newark; ComponentLink24URL: http://sigma.octopart.com:80/conflict_mineral_statement/Yageo-company-3.pdf?src-supplier=Compliance+Statements; ComponentLink24Description: http://sigma.octopart.com:80/conflict_mineral_statement/Yageo-company-3.pdf?src-supplier=Compliance+Statements; ComponentLink25URL: http://sigma.octopart.com:80/rohs_statement/Yageo-company-2.pdf?src-supplier=Compliance+Statements; ComponentLink25Description: http://sigma.octopart.com:80/rohs_statement/Yageo-company-2.pdf?src-supplier=Compliance+Statements
C85 = CAP: 16V 10uF X7R ±10% 0805 Multilayer Ceramic Capacitors MLCC - SMD/SMT ROHS; Manufacturer: Samsung Electro-Mechanics; Manufacturer Part Number: CL21B106KOQNNNE; Tolerance: +-10%; Value: 10µF; Voltage Rating: 16 V; Dielectric: Ceramic; Package Size: 0805; Supplier: DigiKey; Supplier Part Number: 1276-2872-1-ND; RoHS: Compliant; Category: Ceramic Capacitors; Stock: 2003533; Pricing: 1=0.22, 10=0.129, 50=0.0924, 100=0.0811, 500=0.0621, 1000=0.05626, 2000=0.05147, 4000=0.04752, 6000=0.04555, 10000=0.04336, 14000=0.04209, 20000=0.04086, 24000=0.04028, 48000=0.03832, 50000=0.03821 (USD); Case/Package: 0805; Case Code (Imperial): 0805; Case Code (Metric): 2012; China RoHS: Compliant; Contact Plating: Tin; Country of Origin: Mainland China, Philippines, South Korea; Depth: 1.25mm; Dielectric Material: Ceramic; Export Control Classification Number (ECCN) Code: EAR99; Height: 1.4mm; Harmonized Tariff Schedule (HTS) Code: 8532.24.00.20; Introduction Date: 2010-04-09; Length: 2mm; Lifecycle Status: Production; Material: Ceramic; Max Operating Temperature: 125°C; Min Operating Temperature: -55°C; Mounting Technology: Surface Mount; Number of Terminals: 2; Radiation Hardening: No; REACH SVHC: Yes; Schedule B: 8532240020, 8532240020|8532240020, 8532240020|8532240020|8532240020, 8532240020|8532240020|8532240020|8532240020; Thickness: 1.397mm; Voltage: 16V; Voltage Rating (DC): 16V; Width: 1.25mm; ComponentLink1URL: https://datasheet.octopart.com:443/CL21B106KOQNNNE-Samsung-Electro-Mechanics-datasheet-136482503.pdf?src-supplier=IHS; ComponentLink1Description: https://datasheet.octopart.com:443/CL21B106KOQNNNE-Samsung-Electro-Mechanics-datasheet-136482503.pdf?src-supplier=IHS; ComponentLink2URL: https://datasheet.octopart.com:443/CL21B106KOQNNNE-Samsung-Electro-Mechanics-datasheet-116891046.pdf?src-supplier=Future+Electronics; ComponentLink2Description: https://datasheet.octopart.com:443/CL21B106KOQNNNE-Samsung-Electro-Mechanics-datasheet-116891046.pdf?src-supplier=Future+Electronics; ComponentLink3URL: https://datasheet.octopart.com:443/CL21B106KOQNNNE-Samsung-Electro-Mechanics-datasheet-81462191.pdf?src-supplier=Future+Electronics; ComponentLink3Description: https://datasheet.octopart.com:443/CL21B106KOQNNNE-Samsung-Electro-Mechanics-datasheet-81462191.pdf?src-supplier=Future+Electronics; ComponentLink4URL: https://datasheet.octopart.com:443/CL21B106KOQNNNE-Samsung-datasheet-12530662.pdf?src-supplier=Future+Electronics; ComponentLink4Description: https://datasheet.octopart.com:443/CL21B106KOQNNNE-Samsung-datasheet-12530662.pdf?src-supplier=Future+Electronics; ComponentLink5URL: https://datasheet.octopart.com:443/CL21B106KOQNNNE-Samsung-datasheet-26669285.pdf?src-supplier=Future+Electronics; ComponentLink5Description: https://datasheet.octopart.com:443/CL21B106KOQNNNE-Samsung-datasheet-26669285.pdf?src-supplier=Future+Electronics; ComponentLink6URL: https://datasheet.octopart.com:443/CL21B106KOQNNNE-Samsung-Electro-Mechanics-datasheet-149045986.pdf?src-supplier=Future+Electronics; ComponentLink6Description: https://datasheet.octopart.com:443/CL21B106KOQNNNE-Samsung-Electro-Mechanics-datasheet-149045986.pdf?src-supplier=Future+Electronics; ComponentLink7URL: https://datasheet.octopart.com/CL21B106KOQNNNE-Samsung-Electro-Mechanics-datasheet-97040617.pdf; ComponentLink7Description: https://datasheet.octopart.com/CL21B106KOQNNNE-Samsung-Electro-Mechanics-datasheet-97040617.pdf; ComponentLink8URL: https://datasheet.octopart.com/CL21B106KOQNNNE-Samsung-Electro-Mechanics-datasheet-8324245.pdf; ComponentLink8Description: https://datasheet.octopart.com/CL21B106KOQNNNE-Samsung-Electro-Mechanics-datasheet-8324245.pdf; ComponentLink9URL: https://datasheet.octopart.com:443/CL21B106KOQNNNE-Samsung-Electro-Mechanics-datasheet-11806859.pdf?src-supplier=Arrow+Electronics; ComponentLink9Description: https://datasheet.octopart.com:443/CL21B106KOQNNNE-Samsung-Electro-Mechanics-datasheet-11806859.pdf?src-supplier=Arrow+Electronics; ComponentLink10URL: https://datasheet.octopart.com:443/CL21B106KOQNNNE-Samsung-datasheet-8326407.pdf?src-supplier=TME; ComponentLink10Description: https://datasheet.octopart.com:443/CL21B106KOQNNNE-Samsung-datasheet-8326407.pdf?src-supplier=TME
C86 = CAP: 25V 1uF X7R ±10% 0603 Multilayer Ceramic Capacitors MLCC - SMD/SMT ROHS; Manufacturer: Samsung Electro-Mechanics; Manufacturer Part Number: CL10B105KA8NNNC; Tolerance: +-10%; Value: 1µF; Voltage Rating: 25 V; Dielectric: Ceramic; Package Size: 0603; Supplier: DigiKey; Supplier Part Number: 1276-1184-1-ND; RoHS: Compliant; Category: Ceramic Capacitors; Stock: 1060664; Pricing: 1=0.1, 10=0.036, 50=0.0244, 100=0.0208, 500=0.01486, 1000=0.01305 (USD); Case/Package: 0603; Case Code (Imperial): 0603; Case Code (Metric): 1608; China RoHS: Compliant; Contact Plating: Tin; Country of Origin: Mainland China, Philippines, South Korea; Depth: 800µm; Dielectric Material: Ceramic; Export Control Classification Number (ECCN) Code: EAR99; Height: 900µm; Harmonized Tariff Schedule (HTS) Code: 8532.24.00.20; Introduction Date: 2009-11-02; Length: 1.6mm; Lifecycle Status: Production; Material: Ceramic; Max Operating Temperature: 125°C; Min Operating Temperature: -55°C; Mounting Technology: Surface Mount; Number of Terminals: 2; Radiation Hardening: No; REACH SVHC: Yes; Schedule B: 8532240020, 8532240020|8532240020, 8532240020|8532240020|8532240020, 8532240020|8532240020|8532240020|8532240020; Thickness: 889µm; Voltage: 25V; Voltage Rating (DC): 25V; Width: 800µm; ComponentLink1URL: https://datasheet.octopart.com:443/CL10B105KA8NNNC-Samsung-Electro-Mechanics-datasheet-182019882.pdf?src-supplier=IHS; ComponentLink1Description: https://datasheet.octopart.com:443/CL10B105KA8NNNC-Samsung-Electro-Mechanics-datasheet-182019882.pdf?src-supplier=IHS; ComponentLink2URL: https://datasheet.octopart.com:443/CL10B105KA8NNNC-Samsung-Electro-Mechanics-datasheet-106547815.pdf?src-supplier=Upverter; ComponentLink2Description: https://datasheet.octopart.com:443/CL10B105KA8NNNC-Samsung-Electro-Mechanics-datasheet-106547815.pdf?src-supplier=Upverter; ComponentLink3URL: https://datasheet.octopart.com:443/CL10B105KA8NNNC-Samsung-Electro-Mechanics-datasheet-137699931.pdf?src-supplier=Samsung+SCT; ComponentLink3Description: https://datasheet.octopart.com:443/CL10B105KA8NNNC-Samsung-Electro-Mechanics-datasheet-137699931.pdf?src-supplier=Samsung+SCT; ComponentLink4URL: https://datasheet.octopart.com:443/CL10B105KA8NNNC-Samsung-Electro-Mechanics-datasheet-116890983.pdf?src-supplier=Future+Electronics; ComponentLink4Description: https://datasheet.octopart.com:443/CL10B105KA8NNNC-Samsung-Electro-Mechanics-datasheet-116890983.pdf?src-supplier=Future+Electronics; ComponentLink5URL: https://datasheet.octopart.com:443/CL10B105KA8NNNC-Samsung-datasheet-12527851.pdf?src-supplier=Future+Electronics; ComponentLink5Description: https://datasheet.octopart.com:443/CL10B105KA8NNNC-Samsung-datasheet-12527851.pdf?src-supplier=Future+Electronics; ComponentLink6URL: https://datasheet.octopart.com:443/CL10B105KA8NNNC-Samsung-datasheet-26669022.pdf?src-supplier=Future+Electronics; ComponentLink6Description: https://datasheet.octopart.com:443/CL10B105KA8NNNC-Samsung-datasheet-26669022.pdf?src-supplier=Future+Electronics; ComponentLink7URL: https://datasheet.octopart.com:443/CL10B105KA8NNNC-Samsung-Electro-Mechanics-datasheet-149136795.pdf?src-supplier=Future+Electronics; ComponentLink7Description: https://datasheet.octopart.com:443/CL10B105KA8NNNC-Samsung-Electro-Mechanics-datasheet-149136795.pdf?src-supplier=Future+Electronics; ComponentLink8URL: https://datasheet.octopart.com:443/CL10B105KA8NNNC-Samsung-datasheet-37081328.pdf?src-supplier=Future+Electronics; ComponentLink8Description: https://datasheet.octopart.com:443/CL10B105KA8NNNC-Samsung-datasheet-37081328.pdf?src-supplier=Future+Electronics; ComponentLink9URL: https://datasheet.octopart.com/CL10B105KA8NNNC-Samsung-Electro-Mechanics-datasheet-97040617.pdf; ComponentLink9Description: https://datasheet.octopart.com/CL10B105KA8NNNC-Samsung-Electro-Mechanics-datasheet-97040617.pdf; ComponentLink10URL: https://datasheet.octopart.com/CL10B105KA8NNNC-Samsung-Electro-Mechanics-datasheet-8324245.pdf; ComponentLink10Description: https://datasheet.octopart.com/CL10B105KA8NNNC-Samsung-Electro-Mechanics-datasheet-8324245.pdf; ComponentLink11URL: https://datasheet.octopart.com:443/CL10B105KA8NNNC-Samsung-datasheet-59220082.pdf?src-supplier=TME; ComponentLink11Description: https://datasheet.octopart.com:443/CL10B105KA8NNNC-Samsung-datasheet-59220082.pdf?src-supplier=TME; ComponentLink12URL: https://datasheet.octopart.com:443/CL10B105KA8NNNC-Samsung-Electro-Mechanics-datasheet-11897796.pdf?src-supplier=Arrow+Electronics; ComponentLink12Description: https://datasheet.octopart.com:443/CL10B105KA8NNNC-Samsung-Electro-Mechanics-datasheet-11897796.pdf?src-supplier=Arrow+Electronics